# EAGLE design DMD_1_0 (EAGLE 8.3.2)
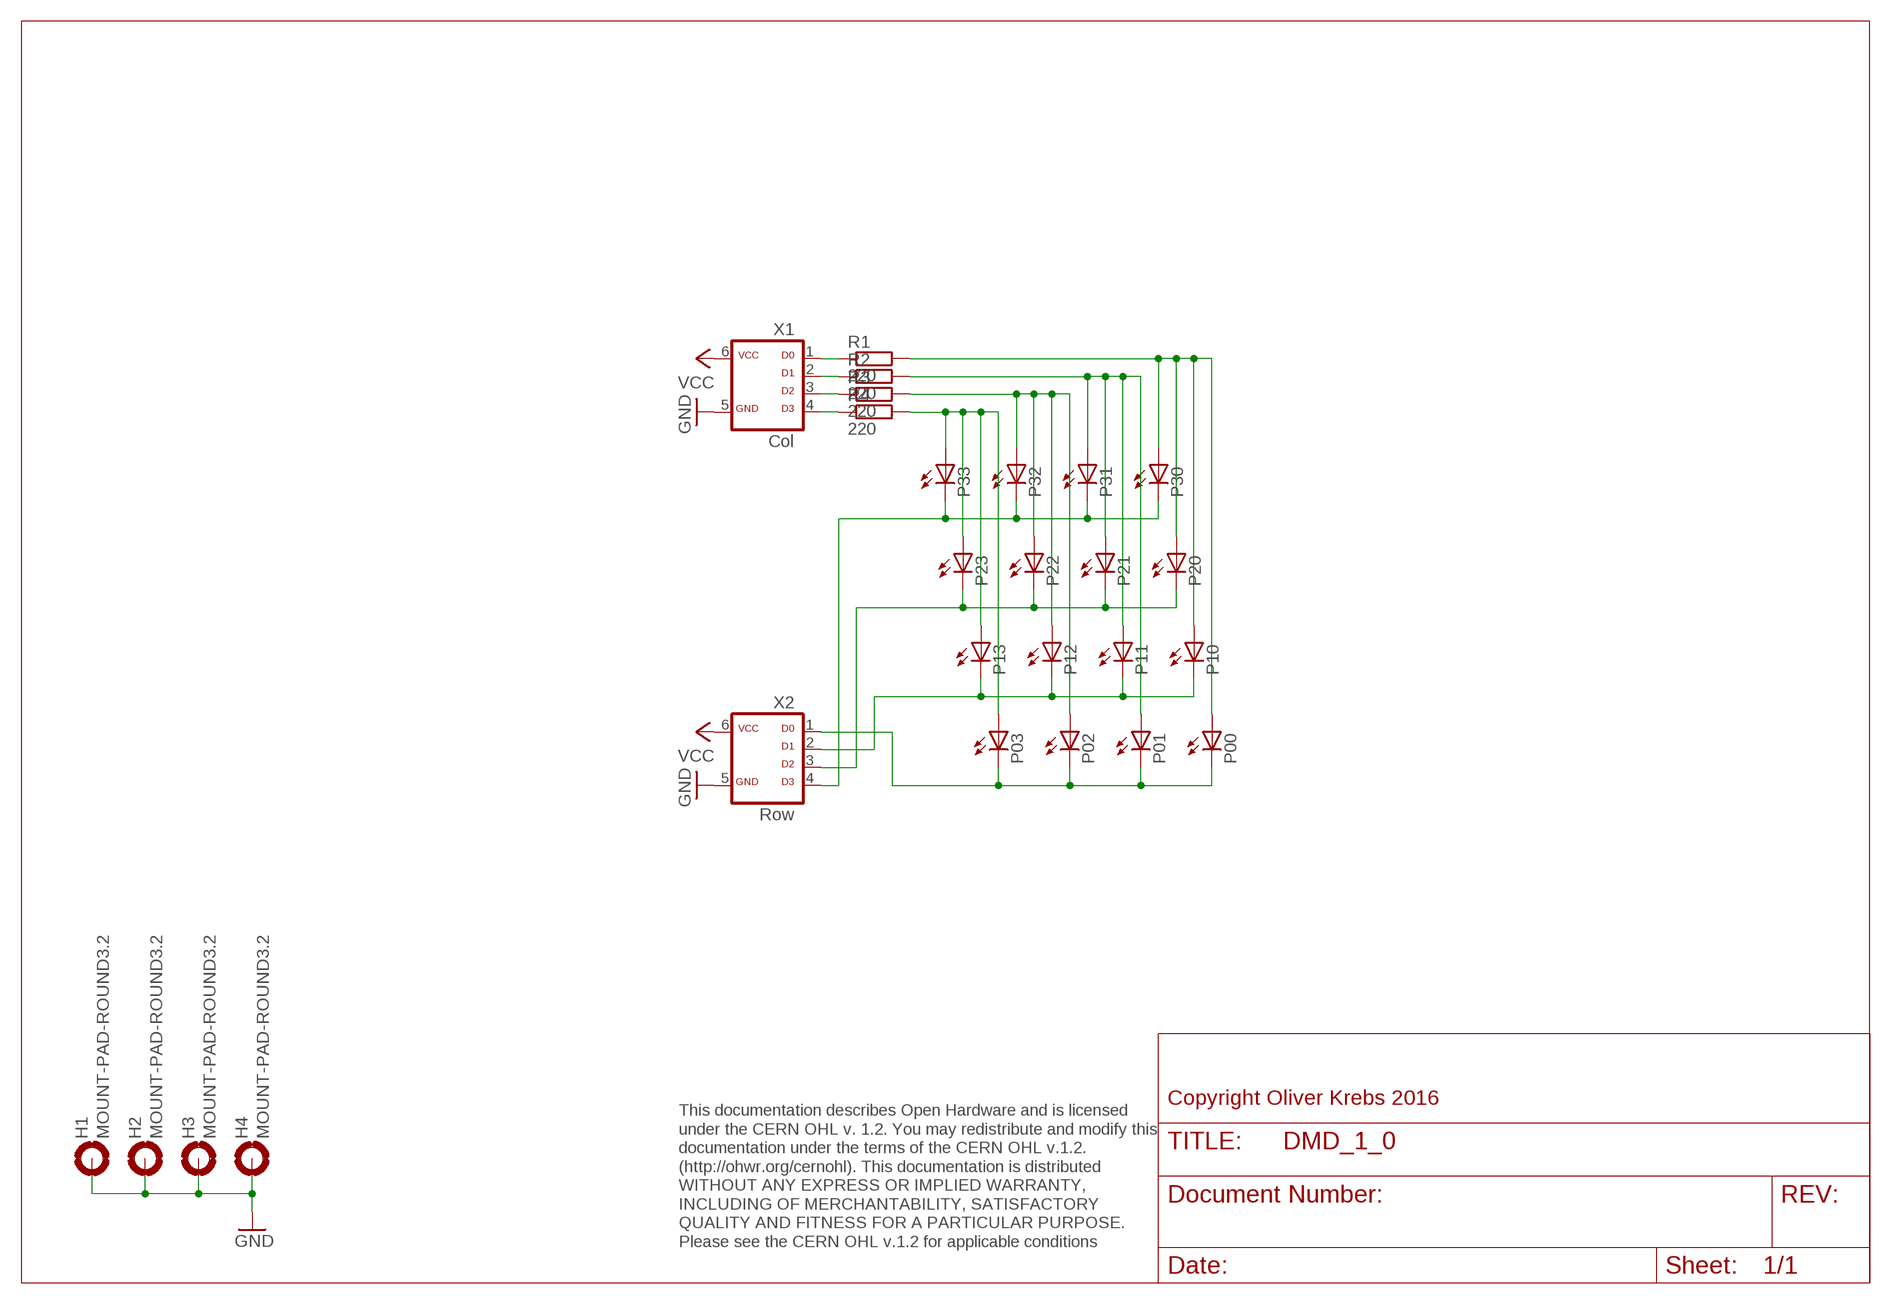
[diagram p0: schematic, sheet 1]

## Parts
H1  MOUNT-PAD-ROUND3.2  [3,2-PAD]
H2  MOUNT-PAD-ROUND3.2  [3,2-PAD]
H3  MOUNT-PAD-ROUND3.2  [3,2-PAD]
H4  MOUNT-PAD-ROUND3.2  [3,2-PAD]
P00  LED5MM  [LED5MM]
P01  LED5MM  [LED5MM]
P02  LED5MM  [LED5MM]
P03  LED5MM  [LED5MM]
P10  LED5MM  [LED5MM]
P11  LED5MM  [LED5MM]
P12  LED5MM  [LED5MM]
P13  LED5MM  [LED5MM]
P20  LED5MM  [LED5MM]
P21  LED5MM  [LED5MM]
P22  LED5MM  [LED5MM]
P23  LED5MM  [LED5MM]
P30  LED5MM  [LED5MM]
P31  LED5MM  [LED5MM]
P32  LED5MM  [LED5MM]
P33  LED5MM  [LED5MM]
R1  220  R-EU_0207/10  [0207/10]
R2  220  R-EU_0207/10  [0207/10]
R3  220  R-EU_0207/10  [0207/10]
R4  220  R-EU_0207/10  [0207/10]
X1  Col  ML6D  [ML-6]
X2  Row  ML6D  [ML-6]

## Nets
COL1: P00.A P10.A P20.A P30.A R1.2
GND: H1.B3,2(MOUNT) H2.B3,2(MOUNT) H3.B3,2(MOUNT) H4.B3,2(MOUNT) X1.5 X2.5
N$3: P01.A P11.A P21.A P31.A R2.2
N$9: R1.1 X1.1
N$10: R2.1 X1.2
N$11: R3.1 X1.3
N$12: R4.1 X1.4
P13: P02.A P12.A P22.A P32.A R3.2
P34: P03.A P13.A P23.A P33.A R4.2
ROW1: P00.K(C) P01.K(C) P02.K(C) P03.K(C) X2.1
ROW2: P10.K(C) P11.K(C) P12.K(C) P13.K(C) X2.2
ROW3: P20.K(C) P21.K(C) P22.K(C) P23.K(C) X2.3
ROW4: P30.K(C) P31.K(C) P32.K(C) P33.K(C) X2.4
VCC: X1.6 X2.6

## Notes on the sheet
- Copyright Oliver Krebs 2016
- This documentation describes Open Hardware and is licensed 
  under the CERN OHL v. 1.2. You may redistribute and modify this 
  documentation under the terms of the CERN OHL v.1.2. 
  (http://ohwr.org/cernohl). This documentation is distributed
  WITHOUT ANY EXPRESS OR IMPLIED WARRANTY, 
  INCLUDING OF MERCHANTABILITY, SATISFACTORY 
  QUALITY AND FITNESS FOR A PARTICULAR PURPOSE. 
  Please see the CERN OHL v.1.2 for applicable conditions

## Library data of the parts
H1-H4 = holes:MOUNT-PAD-ROUND: MOUNTING PAD, round
P00 P01-P03 P10-P13 P20-P23 P30-P33 = 01-my-led:LED: LED OSRAM: - CHIPLED LG R971, LG N971, LY N971, LG Q971, LY Q971, LO R971, LY R971 LH N974, LH R974 LS Q976, LO Q976, LY Q976 LO Q996 - Hyper CHIPLED LW Q18S LB Q993, LB Q99A, LB R99A - SideLED LS A670, LO A670, LY A670, LG A670, LP A670 LB A673, LV A673, LT A673, LW A673 LH A674 LY A675 LS A676, LA A676, LO A676, LY A676, LW A676 LS A679, LY A679, LG A679 - Hyper Micro SIDELED® LS Y876, LA Y876, LO Y876, LY Y876 LT Y87S - SmartLED LW L88C, LW L88S LB L89C, LB L89S, LG L890 LS L89K, LO L89K, LY L89K LS L896, LA L896, LO L896, LY L896 - TOPLED LS T670, LO T670, LY T670, LG T670, LP T670 LSG T670, LSP T670, LSY T670, LOP T670, LYG T670 LG T671, LOG T671, LSG T671 LB T673, LV T673, LT T673, LW T673 LH T674 LS T676, LA T676, LO T676, LY T676, LB T676, LH T676, LSB T676, LW T676 LB T67C, LV T67C, LT T67C, LS T67K, LO T67K, LY T67K, LW E67C LS E67B, LA E67B, LO E67B, LY E67B, LB E67C, LV E67C, LT E67C LW T67C LS T679, LY T679, LG T679 LS T770, LO T770, LY T770, LG T770, LP T770 LB T773, LV T773, LT T773, LW T773 LH T774 LS E675, LA E675, LY E675, LS T675 LS T776, LA T776, LO T776, LY T776, LB T776 LHGB T686 LT T68C, LB T68C - Hyper Mini TOPLED® LB M676 - Mini TOPLED Santana® LG M470 LS M47K, LO M47K, LY M47K Source: http://www.osram.convergy.de LUXEON: - LUMILED® LXK2-PW12-R00, LXK2-PW12-S00, LXK2-PW14-U00, LXK2-PW14-V00 LXK2-PM12-R00, LXK2-PM12-S00, LXK2-PM14-U00 LXK2-PE12-Q00, LXK2-PE12-R00, LXK2-PE12-S00, LXK2-PE14-T00, LXK2-PE14-U00 LXK2-PB12-K00, LXK2-PB12-L00, LXK2-PB12-M00, LXK2-PB14-N00, LXK2-PB14-P00, LXK2-PB14-Q00 LXK2-PR12-L00, LXK2-PR12-M00, LXK2-PR14-Q00, LXK2-PR14-R00 LXK2-PD12-Q00, LXK2-PD12-R00, LXK2-PD12-S00 LXK2-PH12-R00, LXK2-PH12-S00 LXK2-PL12-P00, LXK2-PL12-Q00, LXK2-PL12-R00 Source: www.luxeon.com KINGBRIGHT: KA-3528ASYC Source: www.kingbright.com
R1-R4 = 01-my_rcl:R-EU_: RESISTOR, European symbol
X1 X2 = 01-my-con:ML6D

## Board
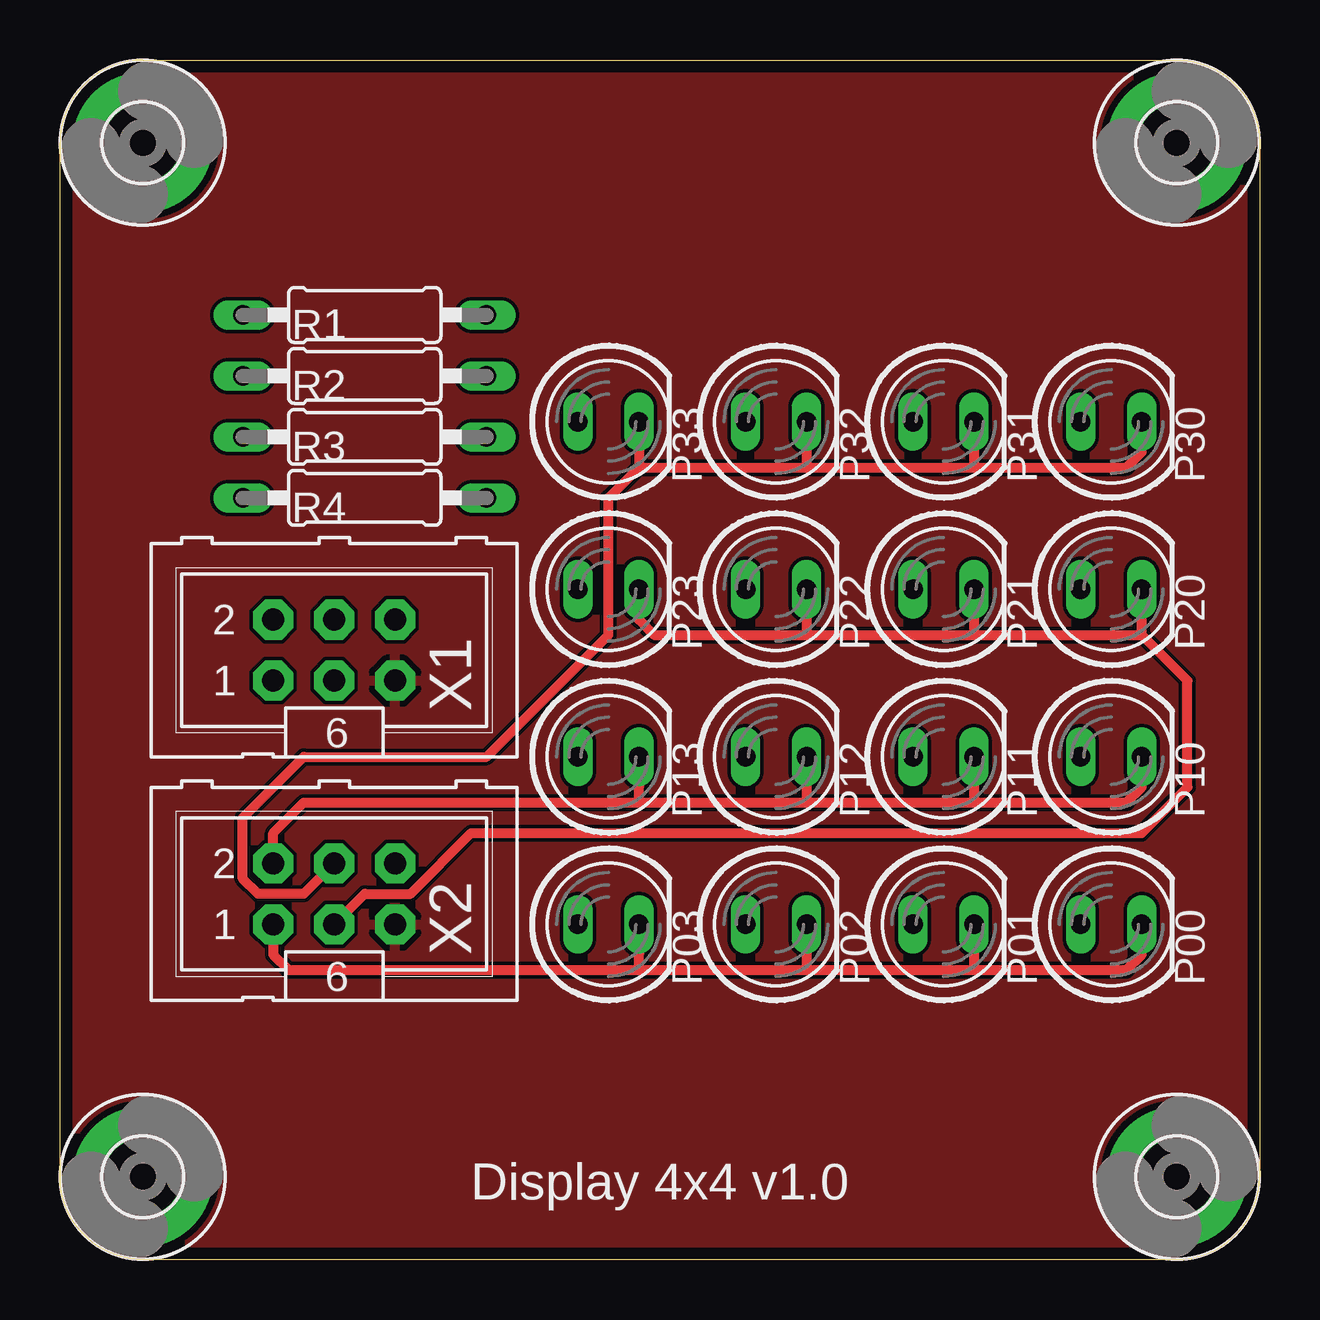
[diagram p1: board, top side]
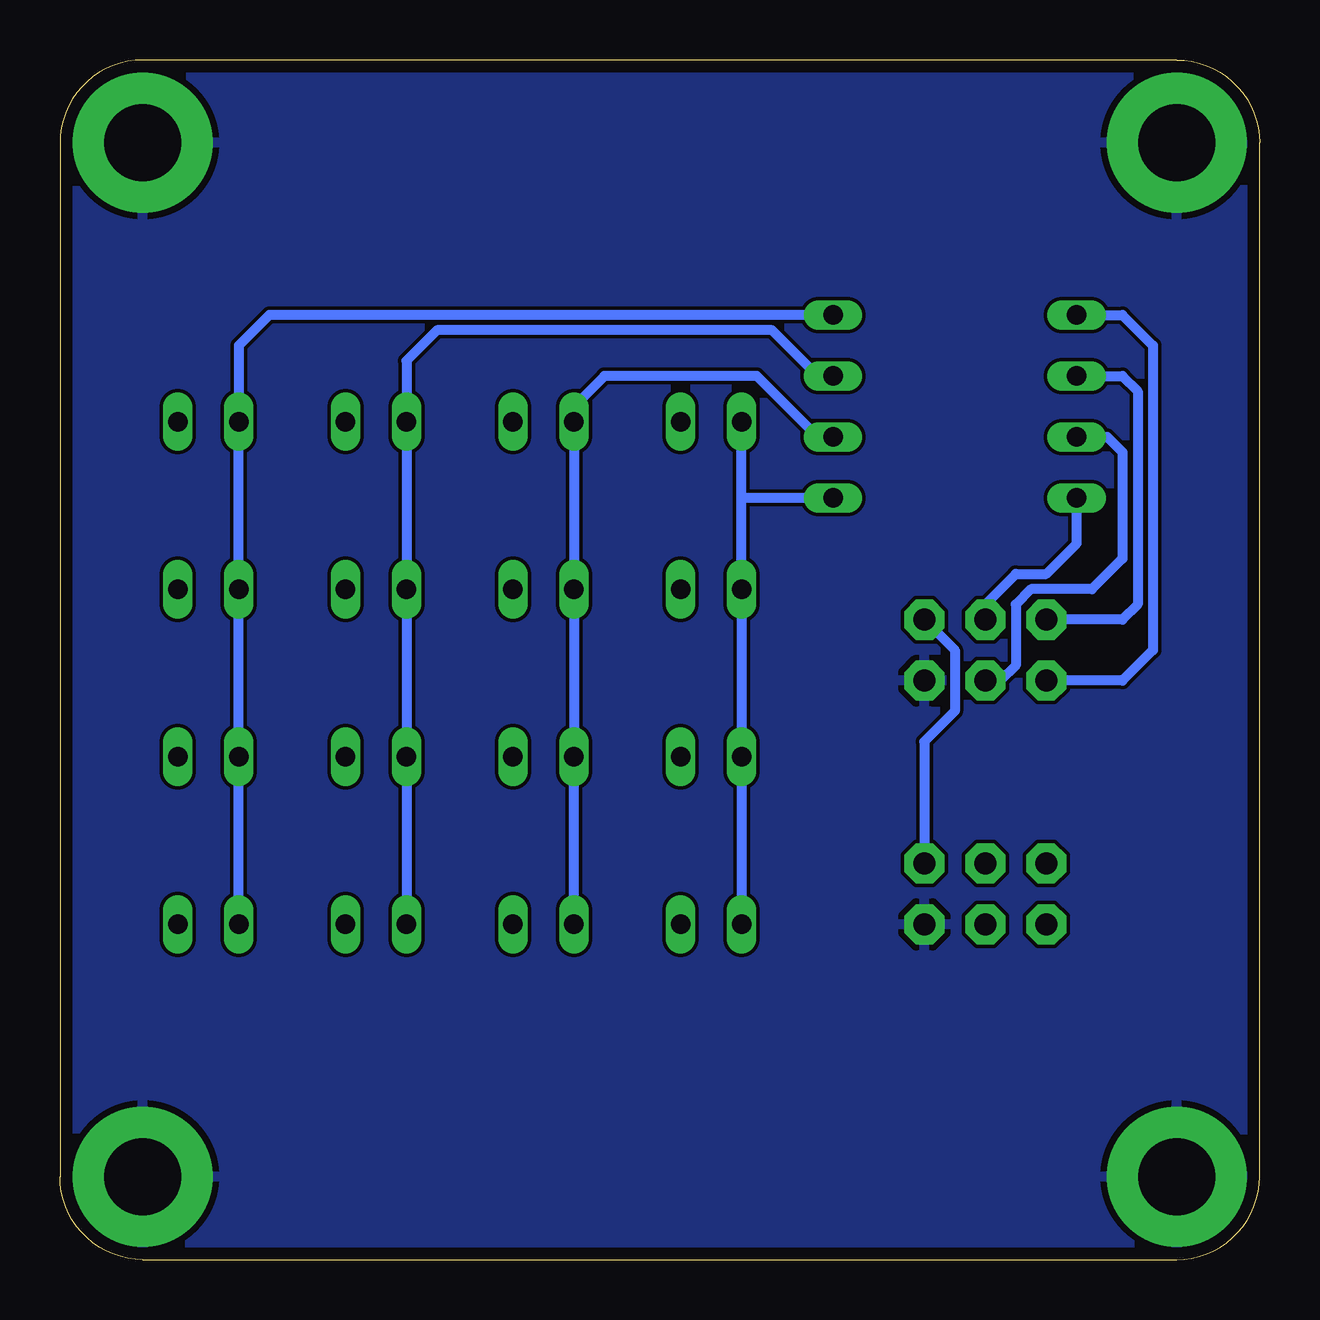
[diagram p2: board, bottom side, seen from below]

Size 50 x 50 mm. Coordinates in mm from the lower left corner, seen from the top.
Outline: 0,3.45 0,46.55 arc-90 3.45,50 46.55,50 arc-90 50,46.55 50,3.45 arc-90 46.55,0 3.45,0 arc-90 0,3.45
Copper layers (1*16): Top 0.035mm / dielectric 1.6mm / Bottom 0.035mm
Design rules "Elecrow_2-layer_PCB_eagle_rule": minimum track width 6mil, minimum drill 12mil, track to track 6mil, track to pad 6mil, pad to pad 6mil, via to via 8mil, smd to smd 0mil, copper to edge 20mil, drill to drill 10mil, minimum pad ring 6mil, minimum via ring 6mil, stop-mask expansion 0mil, vias tented up to drill 100mil, thermal gap 10mil

### Footprints (pad centres in the part's own frame; a part is rotated, then mirrored left to right if it is on the bottom)
3,2-PAD = drill 3.2 pad 5.842: B3,2 0,0
LED5MM = drill 0.813 long: A -1.27,0; K 1.27,0
0207/10 = drill 0.813 long: 1 -5.08,0; 2 5.08,0
ML-6 = drill 0.914 pad 1.676 octagon: 1 -2.54,-1.27; 2 -2.54,1.27; 3 0,-1.27; 4 0,1.27; 5 2.54,-1.27; 6 2.54,1.27

### Placement (x,y rotation side)
H1  3.45,3.45 0 top
H2  3.45,46.55 0 top
H3  46.55,3.45 0 top
H4  46.55,46.55 0 top
P00  43.81,13.97 0 top
P01  36.83,13.97 0 top
P02  29.84,13.97 0 top
P03  22.86,13.97 0 top
P10  43.81,20.95 0 top
P11  36.83,20.95 0 top
P12  29.84,20.95 0 top
P13  22.86,20.95 0 top
P20  43.81,27.94 0 top
P21  36.83,27.94 0 top
P22  29.84,27.94 0 top
P23  22.86,27.94 0 top
P30  43.81,34.92 0 top
P31  36.83,34.92 0 top
P32  29.84,34.92 0 top
P33  22.86,34.92 0 top
R1  12.7,39.37 0 top
R2  12.7,36.83 0 top
R3  12.7,34.29 0 top
R4  12.7,31.75 0 top
X1  11.43,25.4 0 top
X2  11.43,15.24 0 top

### Tracks (layer width: path | path; a pad name or v marks a point on that pad's centre or on a via)
COL1
  Bottom 0.406: R1.2 41.27,39.37 42.55,38.1 P30.A P20.A P10.A P00.A
GND
  pour Bottom: 0,50.16 50.16,50.16 50.16,0 0,0
  pour Top: 0,50.16 50.16,50.16 50.16,0 0,0
N$3
  Bottom 0.406: R2.2 18.41,36.83 20.32,38.73 34.29,38.73 35.56,37.47 P31.A P21.A P11.A P01.A
N$9
  Bottom 0.406: R1.1 5.71,39.37 4.45,38.1 4.45,25.4 5.71,24.13 X1.1
N$10
  Bottom 0.406: R2.1 5.71,36.83 5.08,36.2 5.08,27.3 5.71,26.67 X1.2
N$11
  Bottom 0.406: R3.1 6.35,34.29 5.71,33.66 5.71,29.21 6.99,27.94 9.53,27.94 10.16,27.3 10.16,24.77 10.79,24.13 X1.3
N$12
  Bottom 0.406: X1.4 11.43,27.3 10.16,28.57 8.89,28.57 7.62,29.84 R4.1
P13
  Bottom 0.406: R3.2 18.41,34.29 20.95,36.83 27.3,36.83 28.57,35.56 P32.A P22.A P12.A P02.A
P34
  Bottom 0.406: 21.59,31.75 P23.A P13.A P03.A | 21.59,31.75 P33.A | R4.2 21.59,31.75
ROW1
  Top 0.406: P03.K 24.13,12.7 24.13,12.06 | 24.13,12.06 31.11,12.06 | 31.11,12.06 38.1,12.06 | 38.1,12.06 44.45,12.06 45.09,12.7 P00.K | P01.K 38.1,12.06 | P02.K 31.11,12.06 | X2.1 8.89,12.7 9.53,12.06 24.13,12.06
ROW2
  Top 0.406: P13.K 24.13,19.68 24.13,19.05 | 24.13,19.05 31.11,19.05 | 31.11,19.05 38.1,19.05 | 38.1,19.05 44.45,19.05 45.09,19.68 P10.K | P11.K 38.1,19.05 | P12.K 31.11,19.05 | X2.2 8.89,17.78 10.16,19.05 24.13,19.05
ROW3
  Top 0.406: P23.K 24.13,26.67 24.77,26.04 31.11,26.04 | 31.11,26.04 38.1,26.04 | 38.1,26.04 45.09,26.04 | 45.09,26.04 P20.K | P21.K 38.1,26.04 | P22.K 31.11,26.04 | X2.3 12.7,15.24 14.61,15.24 17.14,17.78 45.09,17.78 46.99,19.68 46.99,24.13 45.09,26.04
ROW4
  Top 0.406: P33.K 24.13,33.02 | 24.13,33.02 31.11,33.02 | 31.11,33.02 38.1,33.02 | 38.1,33.02 44.45,33.02 45.09,33.66 P30.K | P31.K 38.1,33.02 | P32.K 31.11,33.02 | X2.4 10.16,15.24 8.26,15.24 7.62,15.88 7.62,18.41 10.16,20.95 17.78,20.95 22.86,26.04 22.86,31.75 24.13,33.02
VCC
  Bottom 0.406: X1.6 12.7,25.4 12.7,22.86 13.97,21.59 X2.6

### Text on the board
tNames: Display 4x4 v1.0
200bmp: E:/Bilder/Elektronik/Modulion/Mexdulon/mexdulon_50x50_pcb.bmp